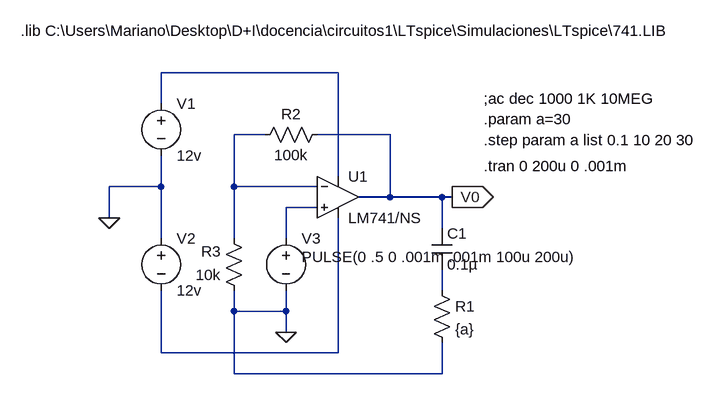
[diagram p0: schematic ej6_g2_sim.asc]
ej6_g2_sim.asc, the LTspice schematic file:
Version 4
SHEET 1 880 680
WIRE 192 -16 -80 -16
WIRE -80 32 -80 -16
WIRE 80 80 32 80
WIRE 272 80 160 80
WIRE 192 144 192 -16
WIRE -80 160 -80 112
WIRE -80 160 -160 160
WIRE 32 160 32 80
WIRE 160 160 32 160
WIRE 272 176 272 80
WIRE 272 176 224 176
WIRE 352 176 272 176
WIRE 368 176 352 176
WIRE 160 192 112 192
WIRE -160 208 -160 160
WIRE 352 224 352 176
WIRE -80 240 -80 160
WIRE 32 240 32 160
WIRE 112 240 112 192
WIRE 352 320 352 288
WIRE 32 352 32 320
WIRE 112 352 112 320
WIRE 112 352 32 352
WIRE 112 384 112 352
WIRE -80 416 -80 320
WIRE 192 416 192 208
WIRE 192 416 -80 416
WIRE 32 448 32 352
WIRE 352 448 352 400
WIRE 352 448 32 448
FLAG -160 208 0
FLAG 112 384 0
FLAG 368 176 V0
IOPIN 368 176 Out
SYMBOL voltage -80 16 R0
WINDOW 123 0 0 Left 0
WINDOW 39 0 0 Left 0
SYMATTR InstName V1
SYMATTR Value 12v
SYMBOL voltage -80 224 R0
WINDOW 123 0 0 Left 0
WINDOW 39 0 0 Left 0
SYMATTR InstName V2
SYMATTR Value 12v
SYMBOL voltage 112 224 R0
WINDOW 123 24 44 Left 2
WINDOW 39 0 0 Left 0
WINDOW 3 24 44 Left 2
SYMATTR Value PULSE(0 .5 0 .001m .001m 100u 200u)
SYMATTR InstName V3
SYMBOL OpAmps\\opamp2 192 112 R0
SYMATTR InstName U1
SYMATTR Value LM741/NS
SYMBOL res 176 64 R90
WINDOW 0 0 56 VBottom 2
WINDOW 3 32 56 VTop 2
SYMATTR InstName R2
SYMATTR Value 100k
SYMBOL res 48 336 R180
WINDOW 0 36 76 Left 2
WINDOW 3 36 40 Left 2
SYMATTR InstName R3
SYMATTR Value 10k
SYMBOL cap 336 224 R0
SYMATTR InstName C1
SYMATTR Value 0.1µ
SYMBOL res 336 304 R0
SYMATTR InstName R1
SYMATTR Value {a}
TEXT -296 -80 Left 2 !.lib C:\\Users\\Mariano\\Desktop\\D+I\\docencia\\circuitos1\\LTspice\\Simulaciones\\LTspice\\741.LIB
TEXT 416 24 Left 2 !;ac dec 1000 1K 10MEG
TEXT 416 88 Left 2 !.step param a list 0.1 10 20 30
TEXT 416 56 Left 2 !.param a=30
TEXT 416 128 Left 2 !.tran 0 200u 0 .001m

The netlist it stands for:
* ej6_g2_sim.asc
V1 N001 0 12v
V2 0 N005 12v
V3 N003 0 PULSE(0 .5 0 .001m .001m 100u 200u)
XU1 N003 N002 N001 N005 V0 LM741/NS  ; pins In+ In- V+ V- OUT
R2 V0 N002 100k
R3 0 N002 10k
C1 V0 N004 0.1µ
R1 N004 0 {a}
.lib C:\Users\Mariano\Desktop\D+I\docencia\circuitos1\LTspice\Simulaciones\LTspice\741.LIB
;ac dec 1000 1K 10MEG
.step param a list 0.1 10 20 30
.param a=30
.tran 0 200u 0 .001m
.backanno
.end